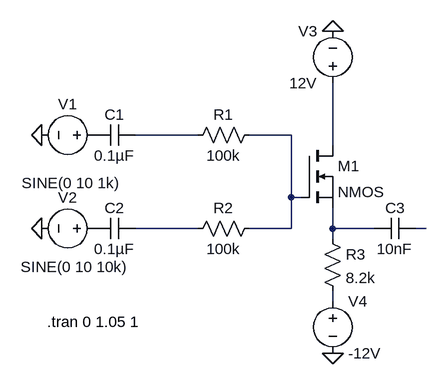
[diagram p0: schematic Mixer_Circuit_Real.asc]
Mixer_Circuit_Real.asc, the LTspice schematic file:
Version 4
SHEET 1 880 680
WIRE 224 80 128 80
WIRE 368 80 304 80
WIRE 432 96 432 0
WIRE 368 176 368 80
WIRE 384 176 368 176
WIRE 224 224 128 224
WIRE 368 224 368 176
WIRE 368 224 304 224
WIRE 432 224 432 192
WIRE 496 224 432 224
WIRE 576 224 560 224
WIRE 432 240 432 224
WIRE 432 336 432 320
FLAG -16 80 0
FLAG -16 224 0
FLAG 432 416 0
FLAG 432 -80 0
SYMBOL cap 128 64 R90
WINDOW 0 0 32 VBottom 2
WINDOW 3 32 32 VTop 2
SYMATTR InstName C1
SYMATTR Value 0.1µF
SYMBOL cap 128 208 R90
WINDOW 0 0 32 VBottom 2
WINDOW 3 32 32 VTop 2
SYMATTR InstName C2
SYMATTR Value 0.1µF
SYMBOL res 320 64 R90
WINDOW 0 0 56 VBottom 2
WINDOW 3 32 56 VTop 2
SYMATTR InstName R1
SYMATTR Value 100k
SYMBOL res 320 208 R90
WINDOW 0 0 56 VBottom 2
WINDOW 3 32 56 VTop 2
SYMATTR InstName R2
SYMATTR Value 100k
SYMBOL nmos 384 96 R0
SYMATTR InstName M1
SYMBOL res 416 224 R0
SYMATTR InstName R3
SYMATTR Value 8.2k
SYMBOL cap 560 208 R90
WINDOW 0 0 32 VBottom 2
WINDOW 3 32 32 VTop 2
SYMATTR InstName C3
SYMATTR Value 10nF
SYMBOL voltage 80 80 R90
WINDOW 0 -32 56 VBottom 2
WINDOW 3 58 51 VTop 2
WINDOW 123 0 0 Left 2
WINDOW 39 0 0 Left 2
SYMATTR InstName V1
SYMATTR Value SINE(0 10 1k)
SYMBOL voltage 80 224 R90
WINDOW 0 -32 56 VBottom 2
WINDOW 3 75 46 VBottom 2
WINDOW 123 0 0 Left 2
WINDOW 39 0 0 Left 2
SYMATTR InstName V2
SYMATTR Value SINE(0 10 10k)
SYMBOL voltage 432 16 R180
WINDOW 0 24 96 Left 2
WINDOW 3 24 16 Left 2
WINDOW 123 0 0 Left 2
WINDOW 39 0 0 Left 2
SYMATTR InstName V3
SYMATTR Value 12V
SYMBOL voltage 432 320 R0
WINDOW 123 0 0 Left 2
WINDOW 39 0 0 Left 2
SYMATTR InstName V4
SYMATTR Value -12V
TEXT -8 368 Left 2 !.tran 0 1.05 1

The netlist it stands for:
* Mixer_Circuit_Real.asc
C1 N001 P001 0.1µF
C2 N004 P002 0.1µF
R1 N002 N001 100k
R2 N002 N004 100k
M1 N003 N002 N005 N005 NMOS
R3 N005 N007 8.2k
C3 N006 N005 10nF
V1 P001 0 SINE(0 10 1k)
V2 P002 0 SINE(0 10 10k)
V3 N003 0 12V
V4 N007 0 -12V
.model NMOS NMOS
.model PMOS PMOS
.lib standard.mos
.tran 0 1.05 1
.backanno
.end